# Altium schematic sheet Esquema final.SchDoc
size A4
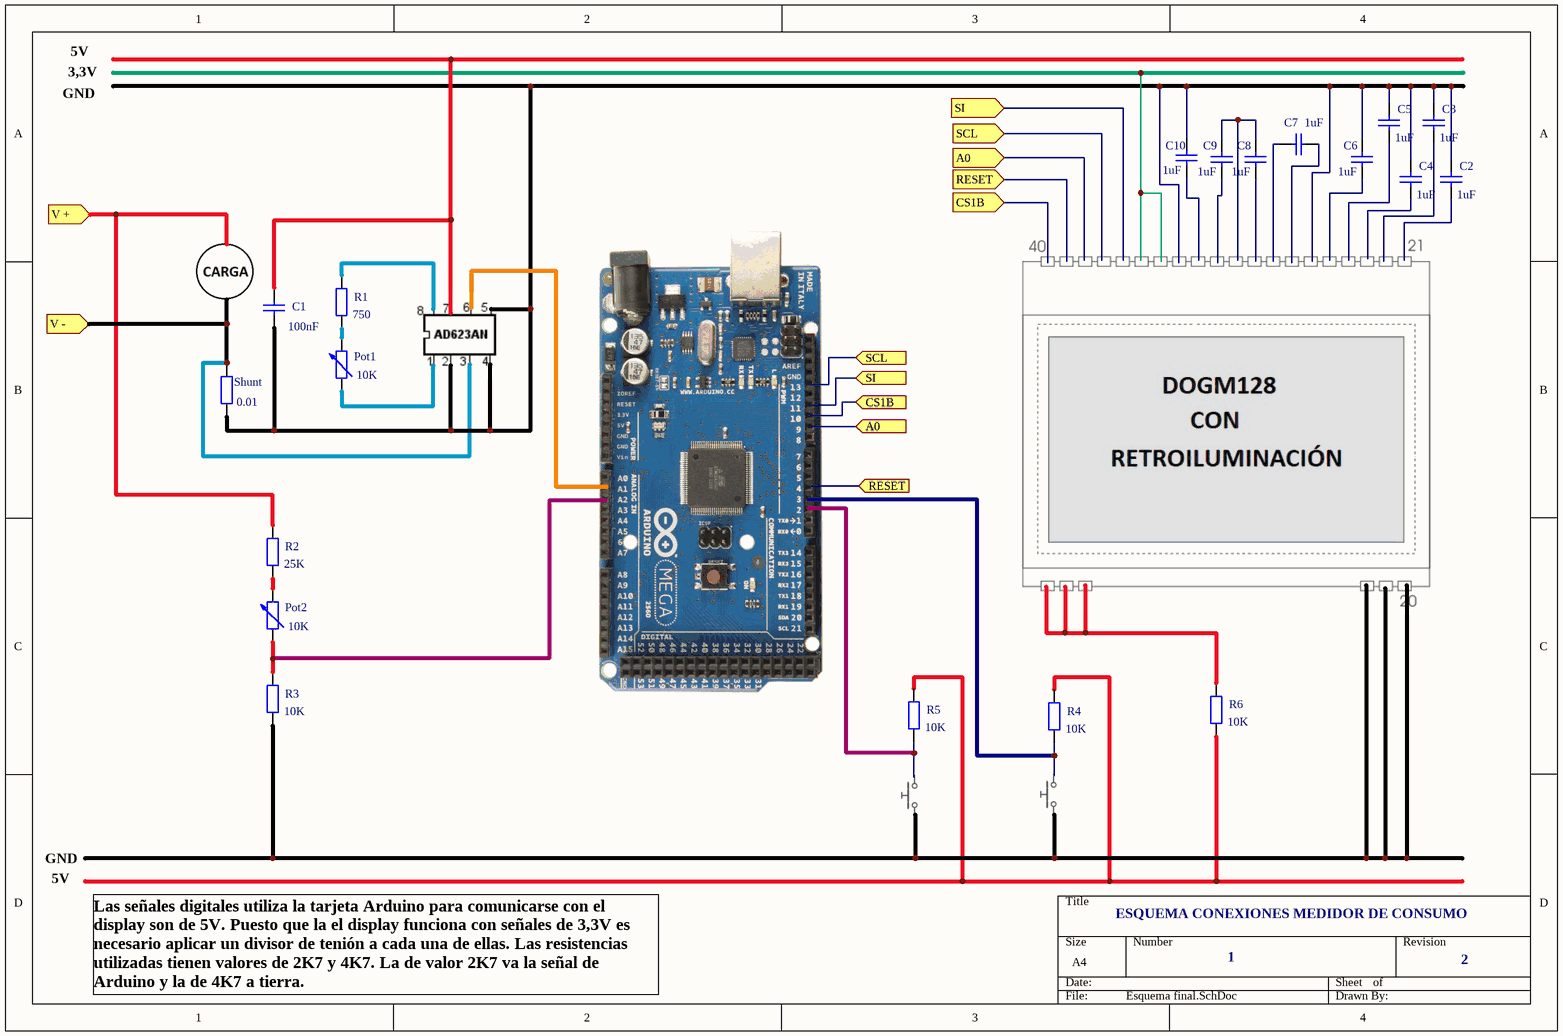
[diagram p0: Esquema final.SchDoc]

## Parts
C1  value 100nF  [RAD-0.3]  (hidden comment: Cap)
C2  value 1uF  [RAD-0.3]  (hidden comment: Cap)
C3  value 1uF  [RAD-0.3]  (hidden comment: Cap)
C4  value 1uF  [RAD-0.3]  (hidden comment: Cap)
C5  value 1uF  [RAD-0.3]  (hidden comment: Cap)
C6  value 1uF  [RAD-0.3]  (hidden comment: Cap)
C7  value 1uF  [RAD-0.3]  (hidden comment: Cap)
C8  value 1uF  [RAD-0.3]  (hidden comment: Cap)
C9  value 1uF  [RAD-0.3]  (hidden comment: Cap)
C10  value 1uF  [RAD-0.3]  (hidden comment: Cap)
Pot1  value 10K  [AXIAL-0.6]  (hidden comment: Res Adj2)
Pot2  value 10K  [AXIAL-0.6]  (hidden comment: Res Adj2)
R1  value 750  [AXIAL-0.4]  (hidden comment: Res2)
R2  value 25K  [AXIAL-0.4]  (hidden comment: Res2)
R3  value 10K  [AXIAL-0.4]  (hidden comment: Res2)
R4  value 10K  [AXIAL-0.4]  (hidden comment: Res2)
R5  value 10K  [AXIAL-0.4]  (hidden comment: Res2)
R6  value 10K  [AXIAL-0.4]  (hidden comment: Res2)
Shunt  value 0.01  [AXIAL-0.4]  (hidden comment: Res2)

## Ports
A0, CS1B, RESET, SCL, SI, V +, V -

## Nets
V +: R2.2 ; port V +
V -: Shunt.2 ; port V -
NetC1_1: C1.1 C2.2 C3.2 C4.2 C5.2 C6.2 C10.2 Shunt.1
NetC8_2: C8.2 C9.2
NetPot1_2: Pot1.2 R1.1
NetPot2_1: Pot2.1 R3.2
NetPot2_2: Pot2.2 R2.1
NetR4_2: R4.2 R5.2 R6.1

Not connected (* = marked no-connect by the designer): C1 2; C2 1; C3 1; C4 1; C5 1; C6 1; C7 1 2; C8 1; C9 1; C10 1; Pot1 1; R1 2; R3 1; R4 1; R5 1; R6 2

## Notes on the sheet
- GND
- 3,3V
- 5V
- ESQUEMA CONEXIONES MEDIDOR DE CONSUMO
- Las señales digitales utiliza la tarjeta Arduino para comunicarse con el display son de 5V. Puesto que la el display funciona con señales de 3,3V es necesario aplicar un divisor de tenión a cada una de ellas. Las resistencias utilizadas tienen valores de 2K7 y 4K7. La de valor 2K7 va la señal de Arduino y la de 4K7 a tierra.
- 1
- 2

## Library data of the parts
C1-C10 = Cap: Capacitor; Published: 8-Jun-2000; LatestRevisionDate: 17-Jul-2002; LatestRevisionNote: Re-released for DXP Platform.; PackageReference: RAD-0.3; Publisher: Altium Limited; PackageDescription: Radial Cap, Thru-Hole; 2 Leads; 0.3 in Pin Spacing
Pot1 Pot2 = Res Adj2: Variable Resistor; Set Position: 0.5; Published: 8-Jun-2000; LatestRevisionDate: 17-Jul-2002; LatestRevisionNote: Re-released for DXP Platform.; PackageReference: AXIAL-0.6; Publisher: Altium Limited; PackageDescription: Axial Device, Thru-Hole; 2 Leads; 0.6 in Pin Spacing
R1-R6 Shunt = Res2: Resistor; Published: 8-Jun-2000; LatestRevisionDate: 17-Jul-2002; LatestRevisionNote: Re-released for DXP Platform.; PackageReference: AXIAL-0.4; Publisher: Altium Limited; PackageDescription: Axial Device, Thru-Hole; 2 Leads; 0.4 in Pin Spacing